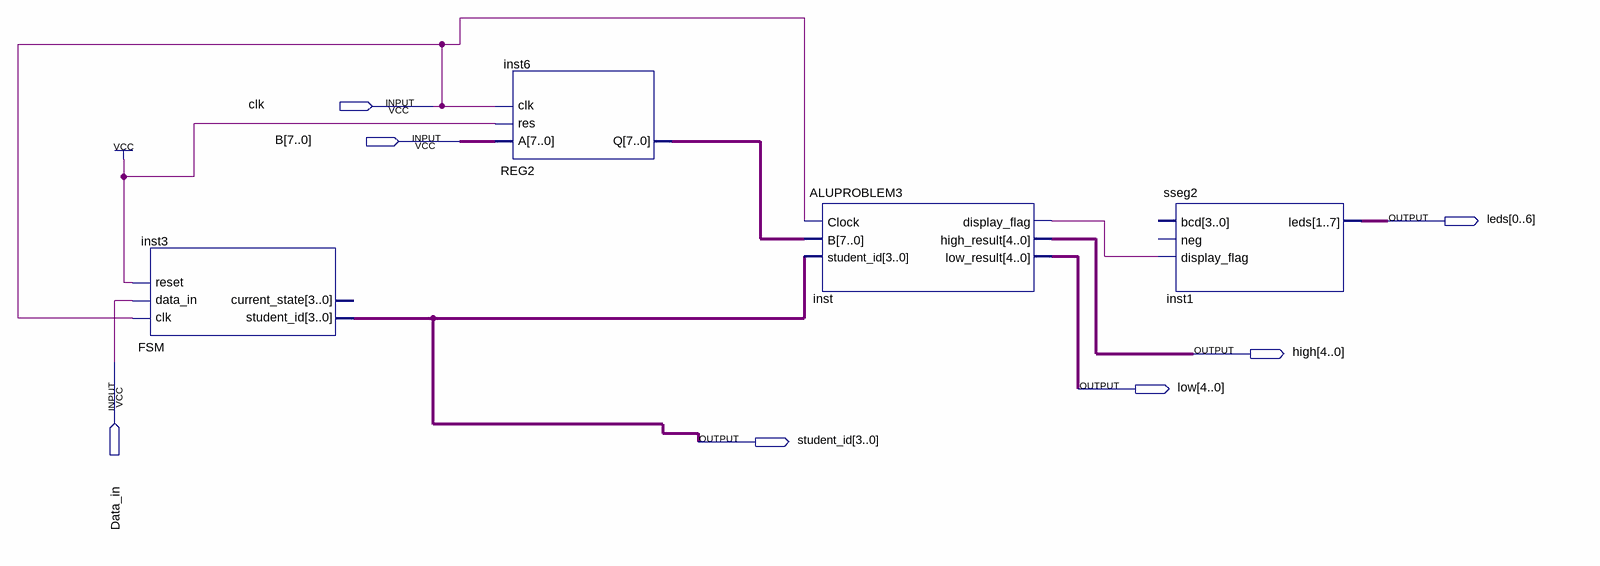
[diagram p0: schematic sheet]
// Quartus schematic LA66.bdf as structural Verilog: 4 symbols, 7 pins
module LA66 (
  input  clk,
  input  [7:0] B,
  input  Data_in,
  output [0:6] leds,
  output [4:0] high,
  output [4:0] low,
  output [3:0] student_id
);

  wire inst_display_flag;
  wire [7:0] inst6_q;

  FSM inst3 (.clk(clk), .data_in(Data_in), .reset(1'b1), .student_id(student_id));  // open: current_state
  REG2 inst6 (.A(B), .res(1'b1), .clk(clk), .Q(inst6_q));
  ALUPROBLEM3 inst (
    .Clock(clk), .B(inst6_q), .student_id(student_id), .display_flag(inst_display_flag), .high_result(high),
    .low_result(low));
  sseg2 inst1 (.display_flag(inst_display_flag), .leds(leds));  // open: bcd, neg
endmodule
